# Altium schematic sheet P4_CCD_CAM_BOARD_MCU.SchDoc
size A4
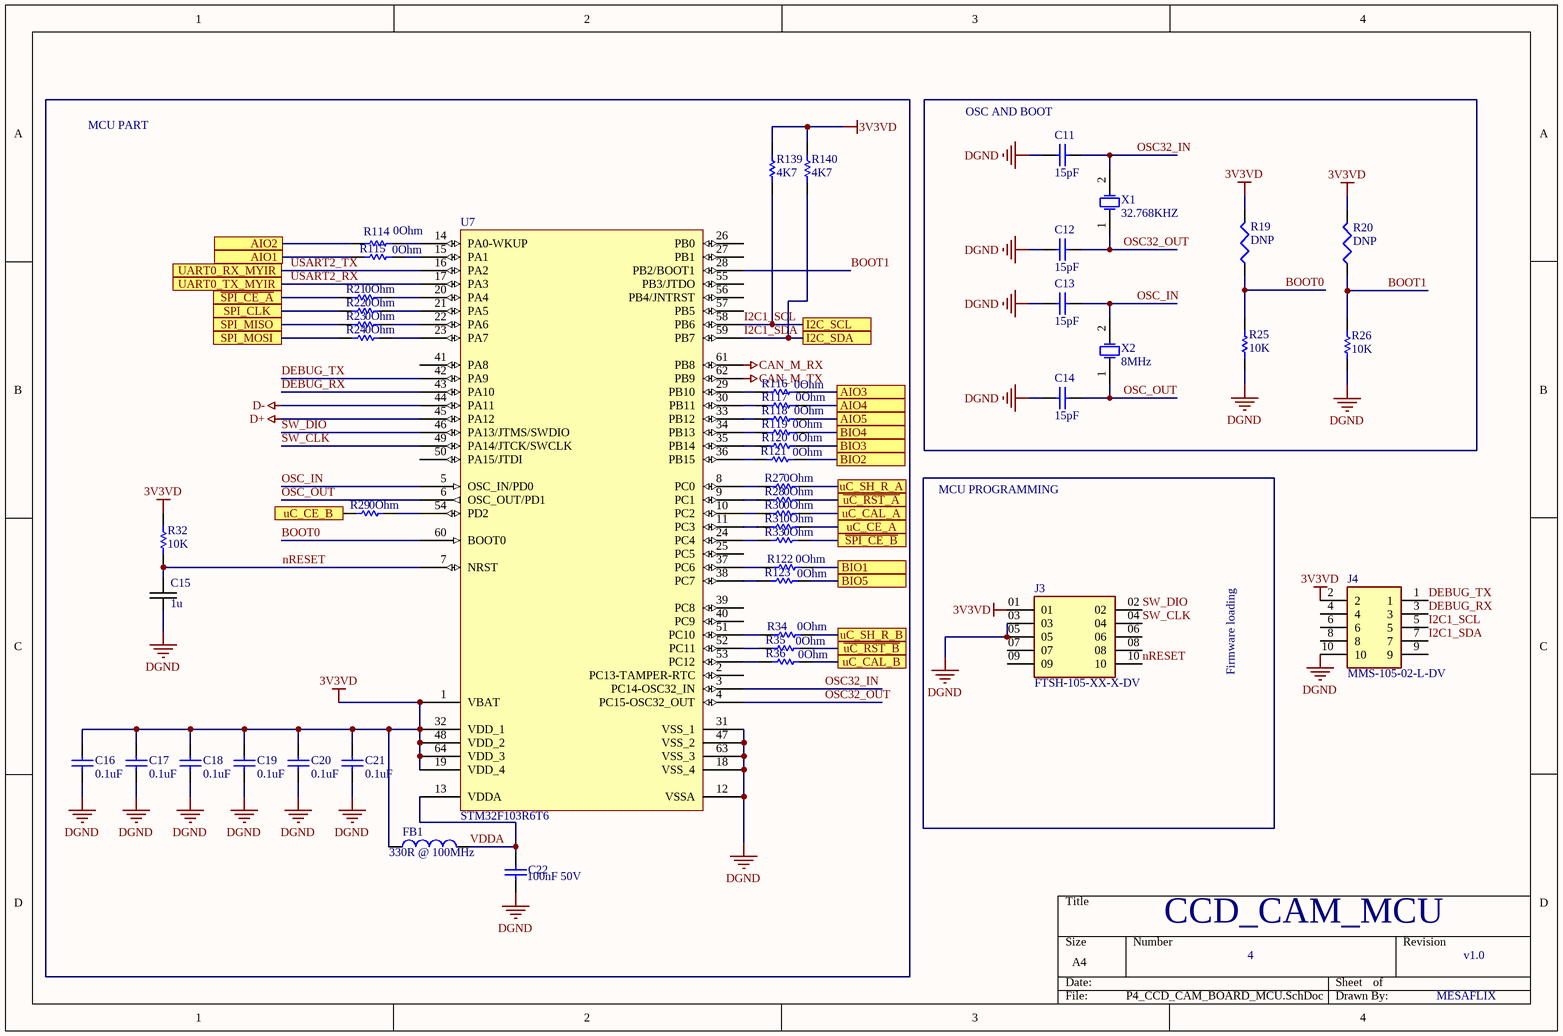
[diagram p0: P4_CCD_CAM_BOARD_MCU.SchDoc]

## Parts
C11  15pF  [CAP0603]
C12  15pF  [CAP0603]
C13  15pF  [CAP0603]
C14  15pF  [CAP0603]
C15  value 1u  [C0603]  (hidden comment: 1uF)
C16  0.1uF  [C 0402(1005)x0.5]
C17  0.1uF  [C 0402(1005)x0.5]
C18  0.1uF  [C 0402(1005)x0.5]
C19  0.1uF  [C 0402(1005)x0.5]
C20  0.1uF  [C 0402(1005)x0.5]
C21  0.1uF  [C 0402(1005)x0.5]
C22  100nF 50V  [CAP0603]
FB1  330R @ 100MHz  [FB0603]
J3  FTSH-105-XX-X-DV  [SAMTEC_FTSH-105-XX-X-DV]
J4  MMS-105-02-L-DV  [SAMTEC_MMS-105-02-L-DV]
R19  Assembly: DNP  [RES0603]  (hidden comment: 10k)
R20  Assembly: DNP  [RES0603]  (hidden comment: 10k)
R21  value 0Ohm  [R 0402(1005)]  (hidden comment: RES_DNP_0603)
R22  value 0Ohm  [R 0402(1005)]  (hidden comment: RES_DNP_0603)
R23  value 0Ohm  [R 0402(1005)]  (hidden comment: RES_DNP_0603)
R24  value 0Ohm  [R 0402(1005)]  (hidden comment: RES_DNP_0603)
R25  value 10K  [RES0603]  (hidden comment: RES_10K_0603)
R26  value 10K  [RES0603]  (hidden comment: RES_10K_0603)
R27  value 0Ohm  [R 0402(1005)]  (hidden comment: RES_DNP_0603)
R28  value 0Ohm  [R 0402(1005)]  (hidden comment: RES_DNP_0603)
R29  value 0Ohm  [R 0402(1005)]  (hidden comment: RES_DNP_0603)
R30  value 0Ohm  [R 0402(1005)]  (hidden comment: RES_DNP_0603)
R31  value 0Ohm  [R 0402(1005)]  (hidden comment: RES_DNP_0603)
R32  value 10K  [RES0603]  (hidden comment: RES_10K_0603)
R33  value 0Ohm  [R 0402(1005)]  (hidden comment: RES_DNP_0603)
R34  value 0Ohm  [R 0402(1005)]  (hidden comment: RES_DNP_0603)
R35  value 0Ohm  [R 0402(1005)]  (hidden comment: RES_DNP_0603)
R36  value 0Ohm  [R 0402(1005)]  (hidden comment: RES_DNP_0603)
R114  value 0Ohm  [R 0402(1005)]  (hidden comment: RES_DNP_0603)
R115  value 0Ohm  [R 0402(1005)]  (hidden comment: RES_DNP_0603)
R116  value 0Ohm  [R 0402(1005)]  (hidden comment: RES_DNP_0603)
R117  value 0Ohm  [R 0402(1005)]  (hidden comment: RES_DNP_0603)
R118  value 0Ohm  [R 0402(1005)]  (hidden comment: RES_DNP_0603)
R119  value 0Ohm  [R 0402(1005)]  (hidden comment: RES_DNP_0603)
R120  value 0Ohm  [R 0402(1005)]  (hidden comment: RES_DNP_0603)
R121  value 0Ohm  [R 0402(1005)]  (hidden comment: RES_DNP_0603)
R122  value 0Ohm  [R 0402(1005)]  (hidden comment: RES_DNP_0603)
R123  value 0Ohm  [R 0402(1005)]  (hidden comment: RES_DNP_0603)
R139  value 4K7  [CAP_RES_1608_0603]  (hidden comment: RES_4K7_0603)
R140  value 4K7  [CAP_RES_1608_0603]  (hidden comment: RES_4K7_0603)
U7  STM32F103R6T6  [LQFP64_N]
X1  32.768KHZ  [CRY_ABS07]
X2  8MHz  [CRY_NX8045GB]

## Ports
AIO1, AIO2, AIO3, AIO4, AIO5, BIO1, BIO2, BIO3, BIO4, BIO5, I2C_SCL, I2C_SDA, SPI_CLK, SPI_MISO, SPI_MOSI, UART0_RX_MYIR, UART0_TX_MYIR, uC_CAL_A, uC_CAL_B, uC_CE_A, uC_CE_B, uC_SH_R_A, uC_SH_R_B, ~{SPI_CE_A}, ~{SPI_CE_B}, ~{uC_RST_A}, ~{uC_RST_B}

## Nets
3V3VD: C16.2 C17.2 C18.2 C19.2 C20.2 C21.2 FB1.1 J3.01 J4.2 R19.2 R20.2 R32.1 R139.1 R140.1 U7.1(VBAT) U7.19(VDD_4) U7.32(VDD_1) U7.48(VDD_2) U7.64(VDD_3)
CAN_M_RX: U7.61(PB8)
CAN_M_TX: U7.62(PB9)
D+: U7.45(PA12)
D-: U7.44(PA11)
DGND: C11.1 C12.1 C13.1 C14.1 C15.2 C16.1 C17.1 C18.1 C19.1 C20.1 C21.1 C22.1 J3.03 J3.05 J4.10 R25.2 R26.2 U7.12(VSSA) U7.18(VSS_4) U7.31(VSS_1) U7.47(VSS_2) U7.63(VSS_3)
AIO1: R115.2 ; port AIO1
AIO2: R114.2 ; port AIO2
AIO3: R116.2 ; port AIO3
AIO4: R117.2 ; port AIO4
AIO5: R118.2 ; port AIO5
BIO1: R122.2 ; port BIO1
BIO2: R121.2 ; port BIO2
BIO3: R120.2 ; port BIO3
BIO4: R119.2 ; port BIO4
BIO5: R123.2 ; port BIO5
BOOT0: R19.1 R25.1 U7.60(BOOT0)
BOOT1: R20.1 R26.1 U7.28(PB2/BOOT1)
DEBUG_RX: J4.3 U7.43(PA10)
DEBUG_TX: J4.1 U7.42(PA9)
I2C1_SCL: J4.5 R139.2 U7.58(PB6) ; port I2C_SCL
I2C1_SDA: J4.7 R140.2 U7.59(PB7) ; port I2C_SDA
nRESET: C15.1 J3.10 R32.2 U7.7(NRST)
OSC32_IN: C11.2 U7.3(PC14-OSC32_IN) X1.2(OSC2)
OSC32_OUT: C12.2 U7.4(PC15-OSC32_OUT) X1.1(OSC1)
OSC_IN: C13.2 U7.5(OSC_IN/PD0) X2.2(OSC2)
OSC_OUT: C14.2 U7.6(OSC_OUT/PD1) X2.1(OSC1)
~{SPI_CE_A}: R21.1 ; port ~{SPI_CE_A}
~{SPI_CE_B}: R33.2 ; port ~{SPI_CE_B}
SPI_CLK: R22.1 ; port SPI_CLK
SPI_MISO: R23.1 ; port SPI_MISO
SPI_MOSI: R24.1 ; port SPI_MOSI
SW_CLK: J3.04 U7.49(PA14/JTCK/SWCLK)
SW_DIO: J3.02 U7.46(PA13/JTMS/SWDIO)
~{uC_RST_A}: R28.2 ; port ~{uC_RST_A}
~{uC_RST_B}: R35.2 ; port ~{uC_RST_B}
uC_CAL_A: R30.2 ; port uC_CAL_A
uC_CAL_B: R36.2 ; port uC_CAL_B
uC_CE_A: R31.2 ; port uC_CE_A
uC_CE_B: R29.1 ; port uC_CE_B
uC_SH_R_A: R27.2 ; port uC_SH_R_A
uC_SH_R_B: R34.2 ; port uC_SH_R_B
USART2_RX: U7.17(PA3) ; port UART0_TX_MYIR
USART2_TX: U7.16(PA2) ; port UART0_RX_MYIR
VDDA: C22.2 FB1.2 U7.13(VDDA)
NetR21_2: R21.2 U7.20(PA4)
NetR22_2: R22.2 U7.21(PA5)
NetR23_2: R23.2 U7.22(PA6)
NetR24_2: R24.2 U7.23(PA7)
NetR27_1: R27.1 U7.8(PC0)
NetR28_1: R28.1 U7.9(PC1)
NetR29_2: R29.2 U7.54(PD2)
NetR30_1: R30.1 U7.10(PC2)
NetR31_1: R31.1 U7.11(PC3)
NetR33_1: R33.1 U7.24(PC4)
NetR34_1: R34.1 U7.51(PC10)
NetR35_1: R35.1 U7.52(PC11)
NetR36_1: R36.1 U7.53(PC12)
NetR114_1: R114.1 U7.14(PA0-WKUP)
NetR115_1: R115.1 U7.15(PA1)
NetR116_1: R116.1 U7.29(PB10)
NetR117_1: R117.1 U7.30(PB11)
NetR118_1: R118.1 U7.33(PB12)
NetR119_1: R119.1 U7.34(PB13)
NetR120_1: R120.1 U7.35(PB14)
NetR121_1: R121.1 U7.36(PB15)
NetR122_1: R122.1 U7.37(PC6)
NetR123_1: R123.1 U7.38(PC7)

Not connected (* = marked no-connect by the designer): J3 06 07 08 09; J4 4 6 8 9; U7 2(PC13-TAMPER-RTC) 25(PC5) 26(PB0) 27(PB1) 39(PC8) 40(PC9) 41(PA8) 50(PA15/JTDI) 55(PB3/JTDO) 56(PB4/JNTRST) 57(PB5)

## Notes on the sheet
- (near C11) OSC AND BOOT
- MCU PART
- MCU PROGRAMMING
- Firmware loading
- CCD_CAM_MCU
- 4
- v1.0
- MESAFLIX

## Library data of the parts
C11-C14 = CAP0603_15pF: CAP CER 15PF 50V C0G/NP0 0603; P/N: 06035A150JAT4A; Order Code: DIGI : 478-10677-1-ND; Value: 15pF 50V
C15 = 1: CAP CER 1UF 25V X7R 0603; Manufacturer Part Number: CL10B105KA8NNNC; ID: 1; Type: Ceramic Capacitor; Package: SMD0603; Digikey Part Number: 1276-1184-1-ND
C16-C21 = Cap: Capacitor; Manufacturer: Murata; Manufacturer Part Number: GRM155R71C104KA88D; Material: Ceramic; Capacitance: 100nF; Tolerance: 10%; Dielectric: X7R; Voltage Rating: 16V; Insulation Resistance: 10GR; Supplier 1: Digi-Key; Supplier Part Number 1: 490-3261-6-ND; Stock 1: 141162259; Pricing 1: 1 = 0,10000, 10 = 0,03300, 100 = 0,01470, 500 = 0,01046, 1000 = 0,00822, 2500 = 0,00748, 5000 = 0,00688 (USD); RoHS: Yes; Mount: Surface Mount; Case/Package: 0402; Number of Pins: 2; Case Code (Metric): 1005; Case Code (Imperial): 0402; Dielectric Material: Ceramic; Min Operating Temperature: -55°C; Max Operating Temperature: 125°C; Packaging: Tape and Reel; Voltage Rating (DC): 16V; Package Quantity: 1; Termination: SMD/SMT; Voltage: 16V; Length: 1mm; Height: 0.5mm; Width: 0.5mm; Thickness: 0.022inch; Depth: 0.5mm; Radiation Hardening: No; REACH SVHC: No SVHC; Lead Free: Lead Free; ComponentLink1URL: https://datasheet.ciiva.com/18102/getdatasheetpartid-85307-18102905.pdf?src-supplier=Verical; ComponentLink1Description: https://datasheet.ciiva.com/18102/getdatasheetpartid-85307-18102905.pdf?src-supplier=Verical; ComponentLink2URL: https://datasheet.ciiva.com/129/grm155r71c104ka88-01-129739.pdf?src-supplier=Digi-Key; ComponentLink2Description: https://datasheet.ciiva.com/129/grm155r71c104ka88-01-129739.pdf?src-supplier=Digi-Key; ComponentLink3URL: https://datasheet.ciiva.com/129/grm155r71c104ka88-01-129740.pdf?src-supplier=Digi-Key; ComponentLink3Description: https://datasheet.ciiva.com/129/grm155r71c104ka88-01-129740.pdf?src-supplier=Digi-Key; ComponentLink4URL: https://datasheet.ciiva.com/29199/454098-da-01-en-vs-kondensator-0402-29199799.pdf?src-supplier=Conrad; ComponentLink4Description: https://datasheet.ciiva.com/29199/454098-da-01-en-vs-kondensator-0402-29199799.pdf?src-supplier=Conrad; ComponentLink5URL: https://datasheet.ciiva.com/28534/4360-28534133.pdf?src-supplier=Element14; ComponentLink5Description: https://datasheet.ciiva.com/28534/4360-28534133.pdf?src-supplier=Element14; ComponentLink6URL: https://datasheet.ciiva.com/14103/grmseries-highdielectrictype-eng-14103750.pdf?src-supplier=Distrelec; ComponentLink6Description: https://datasheet.ciiva.com/14103/grmseries-highdielectrictype-eng-14103750.pdf?src-supplier=Distrelec; ComponentLink7URL: https://datasheet.ciiva.com/16199/product-16199000.pdf?src-supplier=Future+Electronics; ComponentLink7Description: https://datasheet.ciiva.com/16199/product-16199000.pdf?src-supplier=Future+Electronics; ComponentLink8URL: https://datasheet.ciiva.com/14116/grmseries-highdielectrictype-eng-14116878.pdf?src-supplier=Distrelec; ComponentLink8Description: https://datasheet.ciiva.com/14116/grmseries-highdielectrictype-eng-14116878.pdf?src-supplier=Distrelec; ComponentLink9URL: https://datasheet.ciiva.com/7937/4360-7937615.pdf?src-supplier=Element14; ComponentLink9Description: https://datasheet.ciiva.com/7937/4360-7937615.pdf?src-supplier=Element14; ComponentLink10URL: https://datasheet.ciiva.com/28534/4360-28534127.pdf?src-supplier=Element14; ComponentLink10Description: https://datasheet.ciiva.com/28534/4360-28534127.pdf?src-supplier=Element14
C22 = CAP0603_100nF: CAP CER 0.1UF 50V X7R 0603; P/N: C0603C104K5RACTU; Order Code: DIGI : 399-5089-1-ND; Value: 100nF 50V
FB1 = FB0603_330R@100MHz: FERRITE BEAD 330 OHM 0603 1LN; P/N: BLM18SG331TN1D; Order Code: DIGI : 490-3997-1-ND; Value: 330R @ 100MHz
J3 = FTSH-105-XX-X-DV: Connector Header Surface Mount 10 position 0.050 (1.27mm); MF: Samtec; MP: FTSH-105-01-L-DV; SnapEDA_Link: https://www.snapeda.com/parts/FTSH-105-01-L-DV/Samtec/view-part/4795786/?ref=snap; Purchase-URL: https://pricing.snapeda.com/search/part/FTSH-105-01-L-DV/?ref=eda; Check_prices: https://www.snapeda.com/parts/FTSH-105-01-L-DV/Samtec/view-part/4795786/?ref=eda; Value: *; Availability: Bad; Price: None; Package: None
J4 = MMS-105-02-L-DV: 10 Position Receptacle Connector Surface Mount; MF: Samtec; Price: None; Package: None; Toby_UK-Purchase-URL: https://snapeda.com/shop?store=Toby+UK&id=4795617; Availability: Bad; MP: MMS-105-02-L-DV; Value: *; SnapEDA_Link: https://www.snapeda.com/parts/MMS-105-02-L-DV/Samtec/view-part/4795617/?ref=snap
R19 R20 = RES0603_10k: RES SMD 10K OHM 5% 1/10W 0603; Order Code: DIGI : 311-10KGRCT-ND; P/N: RC0603JR-0710KL; Value: 10k
R21-R24 R27-R31 R33-R36 R114-R123 = RES_1K_0603: Manufacturer: Yageo; ManufacturerPartNumber: AC0603FR-070RL; DetailedDesctiprition: 0 Ohms Jumper 0.1W, 1/10W Chip Resistor 0603 (1608 Metric) Automotive AEC-Q200, Moisture Resistant Thick Film; DigikeyPartNumber: 311-0.0LDCT-ND
R25 R26 R32 = RES_1K_0603: Manufacturer: Yageo; ManufacturerPartNumber: AT0603FRE0710KL; DetailedDesctiprition: 10 kOhms ±1% 0.1W, 1/10W Chip Resistor 0603 (1608 Metric) Anti-Sulfur, Automotive AEC-Q200, Moisture Resistant Thin Film; DigikeyPartNumber: YAG2122CT-ND
R139 R140 = RES_1K_0603: Manufacturer: Yageo; ManufacturerPartNumber: AC0603JR-074K7L; DetailedDesctiprition: 4.7 kOhms ±1% 0.05W, 1/20W Chip Resistor 0603 (1608 Metric) Automotive AEC-Q200, Moisture Resistant Thick Film; DigikeyPartNumber: YAG3676CT-ND
U7 = STM32F103R6T6: STM32 ARM-based 32-bit MCU with 32 Kbytes Flash, 64-pin LQFP, Industrial Temperature; Published: 30-May-2008; DatasheetVersion: rev6, Mar-2008; PackageVersion: Mar-2008; PackageReference: LQFP64; Publisher: Altium Limited; PackageDescription: 64-Pin Low-Profile Quad Flat Pack, 10 x 10 mm Body, 0.5 mm Pitch (LQFP64); ComponentLink1Description: Manufacturer Link; ComponentLink1URL: www.st.com/stm32; ComponentLink2Description: Datasheet; ComponentLink2URL: http://www.st.com/stonline/products/literature/ds/13587.pdf
X1 = CRY_32.768KHZ: CRYSTAL 32.768KHZ 12.5PF SMD; P/N: CM7V-T1A-32.768KHZ-12.5PF-20PPM-TB-QA; Order Code: DIGI : 2195-CM7V-T1A-32.768KHZ-12.5PF-20PPM-TB-QACT-ND; Value: 32.768KHZ
X2 = CRY_NX8045GB-8.000M-STD-CSJ-1: CRYSTAL 8.0000MHZ 8PF SMD; Order Code: DIGI : 644-1206-1-ND; P/N: NX8045GB-8.000M-STD-CSJ-1; Value: 8MHz